# Altium project connector_board.PrjPcb
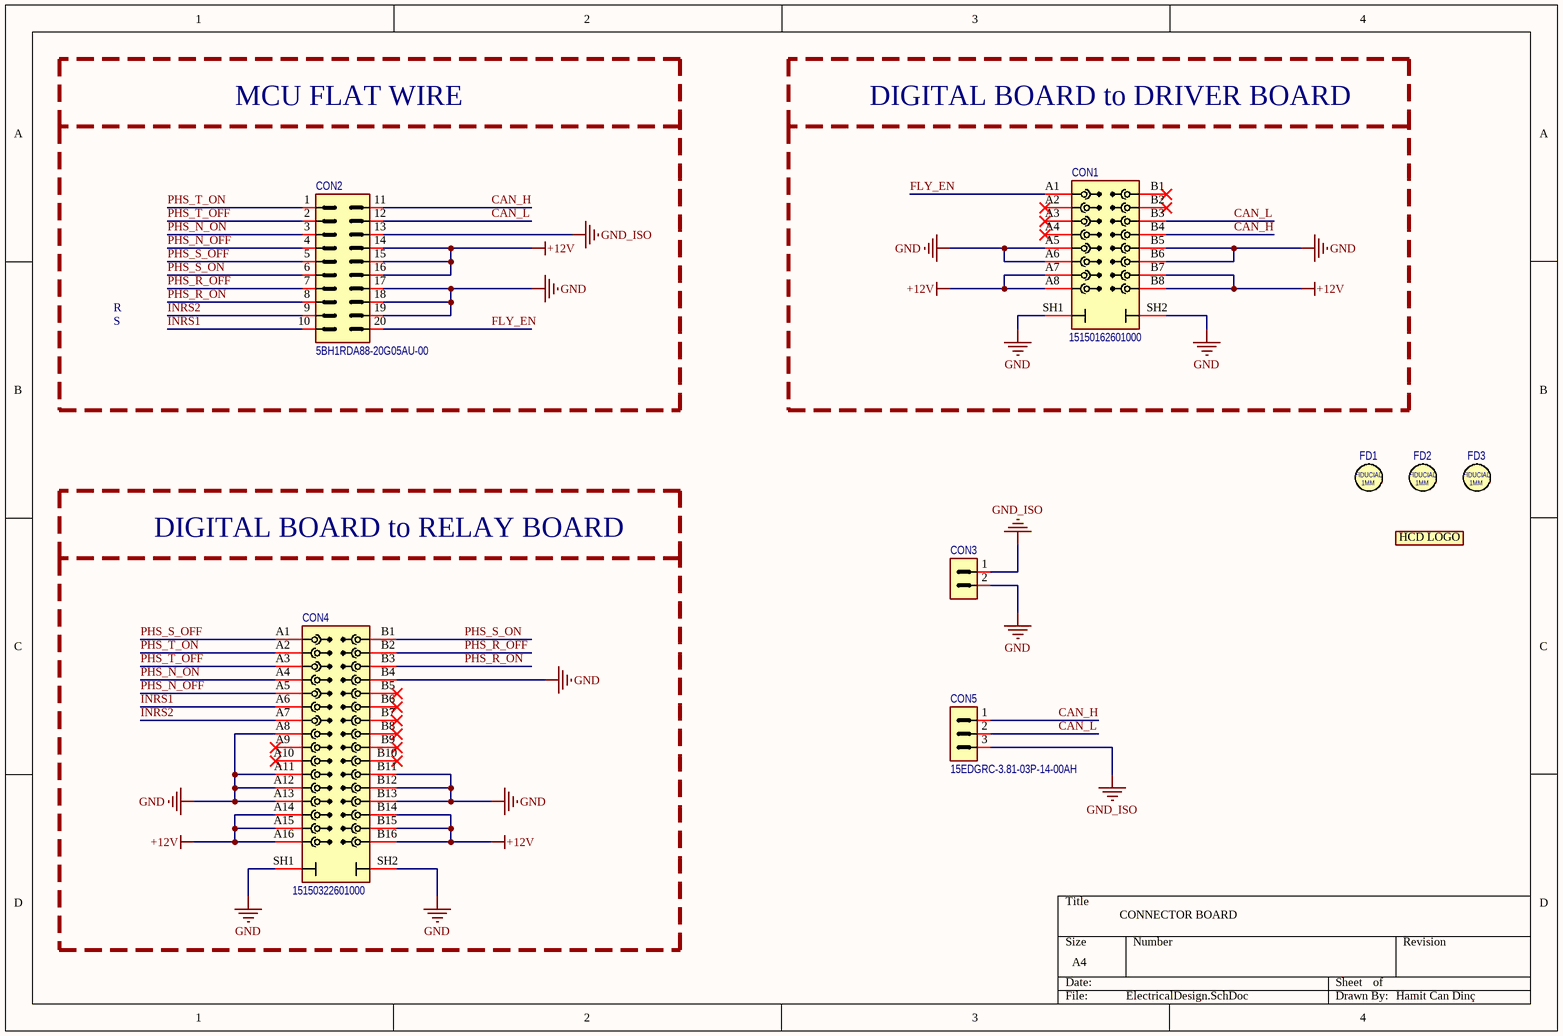
[diagram p0: ElectricalDesign.SchDoc]
1 sheet, 9 parts. Net scope: global (net labels, ports and power ports of the same name join across sheets).
Board file: LayoutDesign.PcbDoc

## Sheet ElectricalDesign.SchDoc: Connector Board
size A4; DrawnBy: Hamit Can Dinç; SheetNumber: 1; SheetTotal: 1

### Parts
CON1  Manufacturer PN: 15150162601000  [CON_15150162601000_HARTING]  (hidden comment: CON_16P_2R_A8-B8_2SH)
CON2  Manufacturer PN: 5BH1RDA88-20G05AU-00  [male-thd-box-header-2x10-2.54mm-90D_AMTEK]  (hidden comment: CON_20POS_2R)
CON3  CON_2POS_1R  [male-thd-1x2-pin-header-2.54mm-90D]  (value not drawn)
CON4  Manufacturer PN: 15150322601000  [CON_15150322601000_HARTING]  (hidden comment: CON_32P_2R_A16-B16_2SH)
CON5  Manufacturer PN: 15EDGRC-3.81-03P-14-00AH  [CON_15EDGRC-3.81-03P-14-00AH]  (hidden comment: CON_3POS_1R)
FD1  FIDUCIAL  [FIDUCIAL_1mm]  (value not drawn)
FD2  FIDUCIAL  [FIDUCIAL_1mm]  (value not drawn)
FD3  FIDUCIAL  [FIDUCIAL_1mm]  (value not drawn)
LOGO1  HCD_LOGO  [HCD_LOGO_V1]  (value not drawn)  (no BOM)

### Blocks framed on the sheet
MCU FLAT WIRE: CON2
DIGITAL BOARD to DRIVER BOARD: CON1
DIGITAL BOARD to RELAY BOARD: CON4

### Nets
+12V: CON1.A7 CON1.A8 CON1.B7 CON1.B8 CON2.14 CON2.15 CON2.16 CON4.A14 CON4.A15 CON4.A16 CON4.B14 CON4.B15 CON4.B16
GND: CON1.A5 CON1.A6 CON1.B5 CON1.B6 CON1.SH1 CON1.SH2 CON2.17 CON2.18 CON2.19 CON3.2 CON4.A8 CON4.A11 CON4.A12 CON4.A13 CON4.B4 CON4.B11 CON4.B12 CON4.B13 CON4.SH1 CON4.SH2
GND_ISO: CON2.13 CON3.1 CON5.3
CAN_H: CON1.B4 CON2.11 CON5.1
CAN_L: CON1.B3 CON2.12 CON5.2
FLY_EN: CON1.A1 CON2.20
INRS1: CON2.10 CON4.A6
INRS2: CON2.9 CON4.A7
PHS_N_OFF: CON2.4 CON4.A5
PHS_N_ON: CON2.3 CON4.A4
PHS_R_OFF: CON2.7 CON4.B2
PHS_R_ON: CON2.8 CON4.B3
PHS_S_OFF: CON2.5 CON4.A1
PHS_S_ON: CON2.6 CON4.B1
PHS_T_OFF: CON2.2 CON4.A3
PHS_T_ON: CON2.1 CON4.A2

Not connected (* = marked no-connect by the designer): CON1 A2* A3* A4* B1* B2*; CON4 A9* A10* B5* B6* B7* B8* B9* B10*

### Notes on the sheet
- R
- S
- CONNECTOR BOARD
- Hamit Can Dinç
- (in symbol 1MM_FIDUCIAL) 1MM
- (in symbol HCD_LOGO_V1) HCD LOGO

### Library data of the parts
CON1 = CONN_MALE_BXHDR_16POS_2R_1.27MM_SMD_90D_15150162601000: Connector Header Surface Mount, Right Angle 16 position 0.050" (1.27mm); Manufacturer: HARTING; Temp# Operating: -55°C ~ 125°C; Lead Status: ROHS3 Compliant; Max Reflow Duration: 10s; Max Reflow Temp: 260C; Identifier: CONN_MALE_BXHDR_16POS_2R_1.27MM_SMD_90D_15150162601000; Component Type: Connector; Distributor: Digikey; Voltage: N/A; Current: N/A; Height: 4.25; Features: Contact Finish-Mating - Gold_Contact Finish-Post - Tin_Contact Material - Copper Alloy_Material Flammability Rating - UL94 V-0; Mounting Type: SMD; MSL: 1; Supplier URL: https://www.digikey.com/en/products/detail/harting/15150162601000/3854911?s=N4IgTCBcDaIIwFZEAY4DYxtcnIC6AvkA
CON2 = CONN_MALE_BXHDR_20POS_2R_2.54MM_THD_90D_5BH1RDA88-20G05AU-00: BOX HEADER 20PIN(2x10) 2.54mm THT R/A MALE BLACK; Manufacturer: AMTEK; Voltage: 1000V AC; Current: 3A; Temp# Operating: -45°C ~ 105°C; Lead Status: ROHS3 Compliant; Max Reflow Duration: 10s; Max Reflow Temp: 260C; Identifier: CONN_MALE_BXHDR_20POS_2R_2.54MM_THD_90D_5BH1RDA88-20G05AU-00; Component Type: Box Header; Distributor: Özdisan; Height: 10.32mm; MSL: 1; Features: Flat kablo konnektörü; Mounting Type: THD; Supplier URL: https://www.ozdisan.com/konnektor-ve-baglanti-elemanlari/header-konnektorler/box-headerlar/5BH1RDA88-20G05AU-00/485576
CON3 = PINHDR_MALE_HEADER_2POS_1R_2.54mm_THD_90D: PIN HEADER 2PIN(1x2) 2.54mm THT R/A 6X3X4.5MM; Manufacturer PN: 5PH1RUA25-102G0NNBL6X3X4; Manufacturer: AMTEK; Voltage: 500V AC; Temp# Operating: -40°C ~ 105°C; Lead Status: ROHS3 Compliant; Max Reflow Duration: 10s; Max Reflow Temp: 260C; Identifier: PINHDR_MALE_HEADER_2POS_1R_2.54mm_THD_90D; Component Type: Pin Header; Distributor: Özdisan; MSL: 1; Features: Pin Header; Mounting Type: THD; Tolerance: N/A; Supplier URL: https://ozdisan.com/konnektor-ve-baglanti-elemanlari/header-konnektorler/pin-headerlar/5PH1RUA25-102G0NNBL6X3X4/959033
CON4 = CONN_MALE_BXHDR_32POS_2R_1.27MM_SMD_90D_15150322601000: Connector Header Surface Mount, Right Angle 32 position 0.050" (1.27mm); Manufacturer: HARTING; Temp# Operating: -55°C ~ 125°C; Lead Status: ROHS3 Compliant; Max Reflow Duration: 10s; Max Reflow Temp: 260C; Identifier: CONN_MALE_BXHDR_32POS_2R_1.27MM_SMD_90D_15150322601000; Component Type: Connector; Distributor: Digikey; Voltage: N/A; Current: N/A; Height: 4.25; Features: Contact Finish-Mating - Gold_Contact Finish-Post - Tin_Contact Material - Copper Alloy_Material Flammability Rating - UL94 V-0; Mounting Type: SMD; MSL: 1; Supplier URL: https://www.digikey.com/en/products/detail/harting/15150322601000/3854914?s=N4IgTCBcDaIIwFZEAYDMYwDZl2XkAugL5A
CON5 = KLEMENS_PLG-IN_MALE_3POS_1R_3.81mm_THD_90D_15EDGRC-3.81-03P-14-00AH: TERM.BLK.3.81MM 3P 90C MALE GREEN CLOSED; Manufacturer: DEGSON; Voltage: 300V; Current: 8A; Temp# Operating: -40°C ~ 105°C; Lead Status: ROHS3 Compliant; Max Reflow Duration: 10s; Max Reflow Temp: 260C; Identifier: KLEMENS_PLG-IN_MALE_3POS_1R_3.81mm_THD_90D_15EDGRC-3.81-03P-14-00AH; Component Type: Klemens; Distributor: Özdisan; Height: 9.2mm; Temp# Storage: N/A; MSL: 1; Features: Geçmeli klemens; Mounting Type: THD; Supplier URL: https://ozdisan.com/konnektor-ve-baglanti-elemanlari/klemensler/gecmeli-klemensler/15EDGRC-3-81-03P-14-00AH/701115
FD1-FD3 = 1MM_FIDUCIAL: Fiducial 1mm; Identifier: 1MM_FIDUCIAL; Component Type: Fiducial; Distributor: N/A; Manufacturer PN: N/A; Manufacturer: N/A; Voltage: N/A; Current: N/A; Height: N/A; Temp# Operating: N/A; Lead Status: N/A; MSL: N/A; ComponentLinkURL: N/A; Cost: N/A; Features: N/A; Mounting Type: SMD; Part Status: N/A; Package: FIDUCIAL_1mm; Temp# Storage1: N/A; Max Reflow Duration: N/A; Max Reflow Temp: N/A
LOGO1 = HCD_LOGO_V1: Hamit Can Dinç LOGO; Identifier: HCD_LOGO_V1; Component Type: LOGO